# EAGLE design base-6u-generic-m16-v1 (EAGLE 4.16)
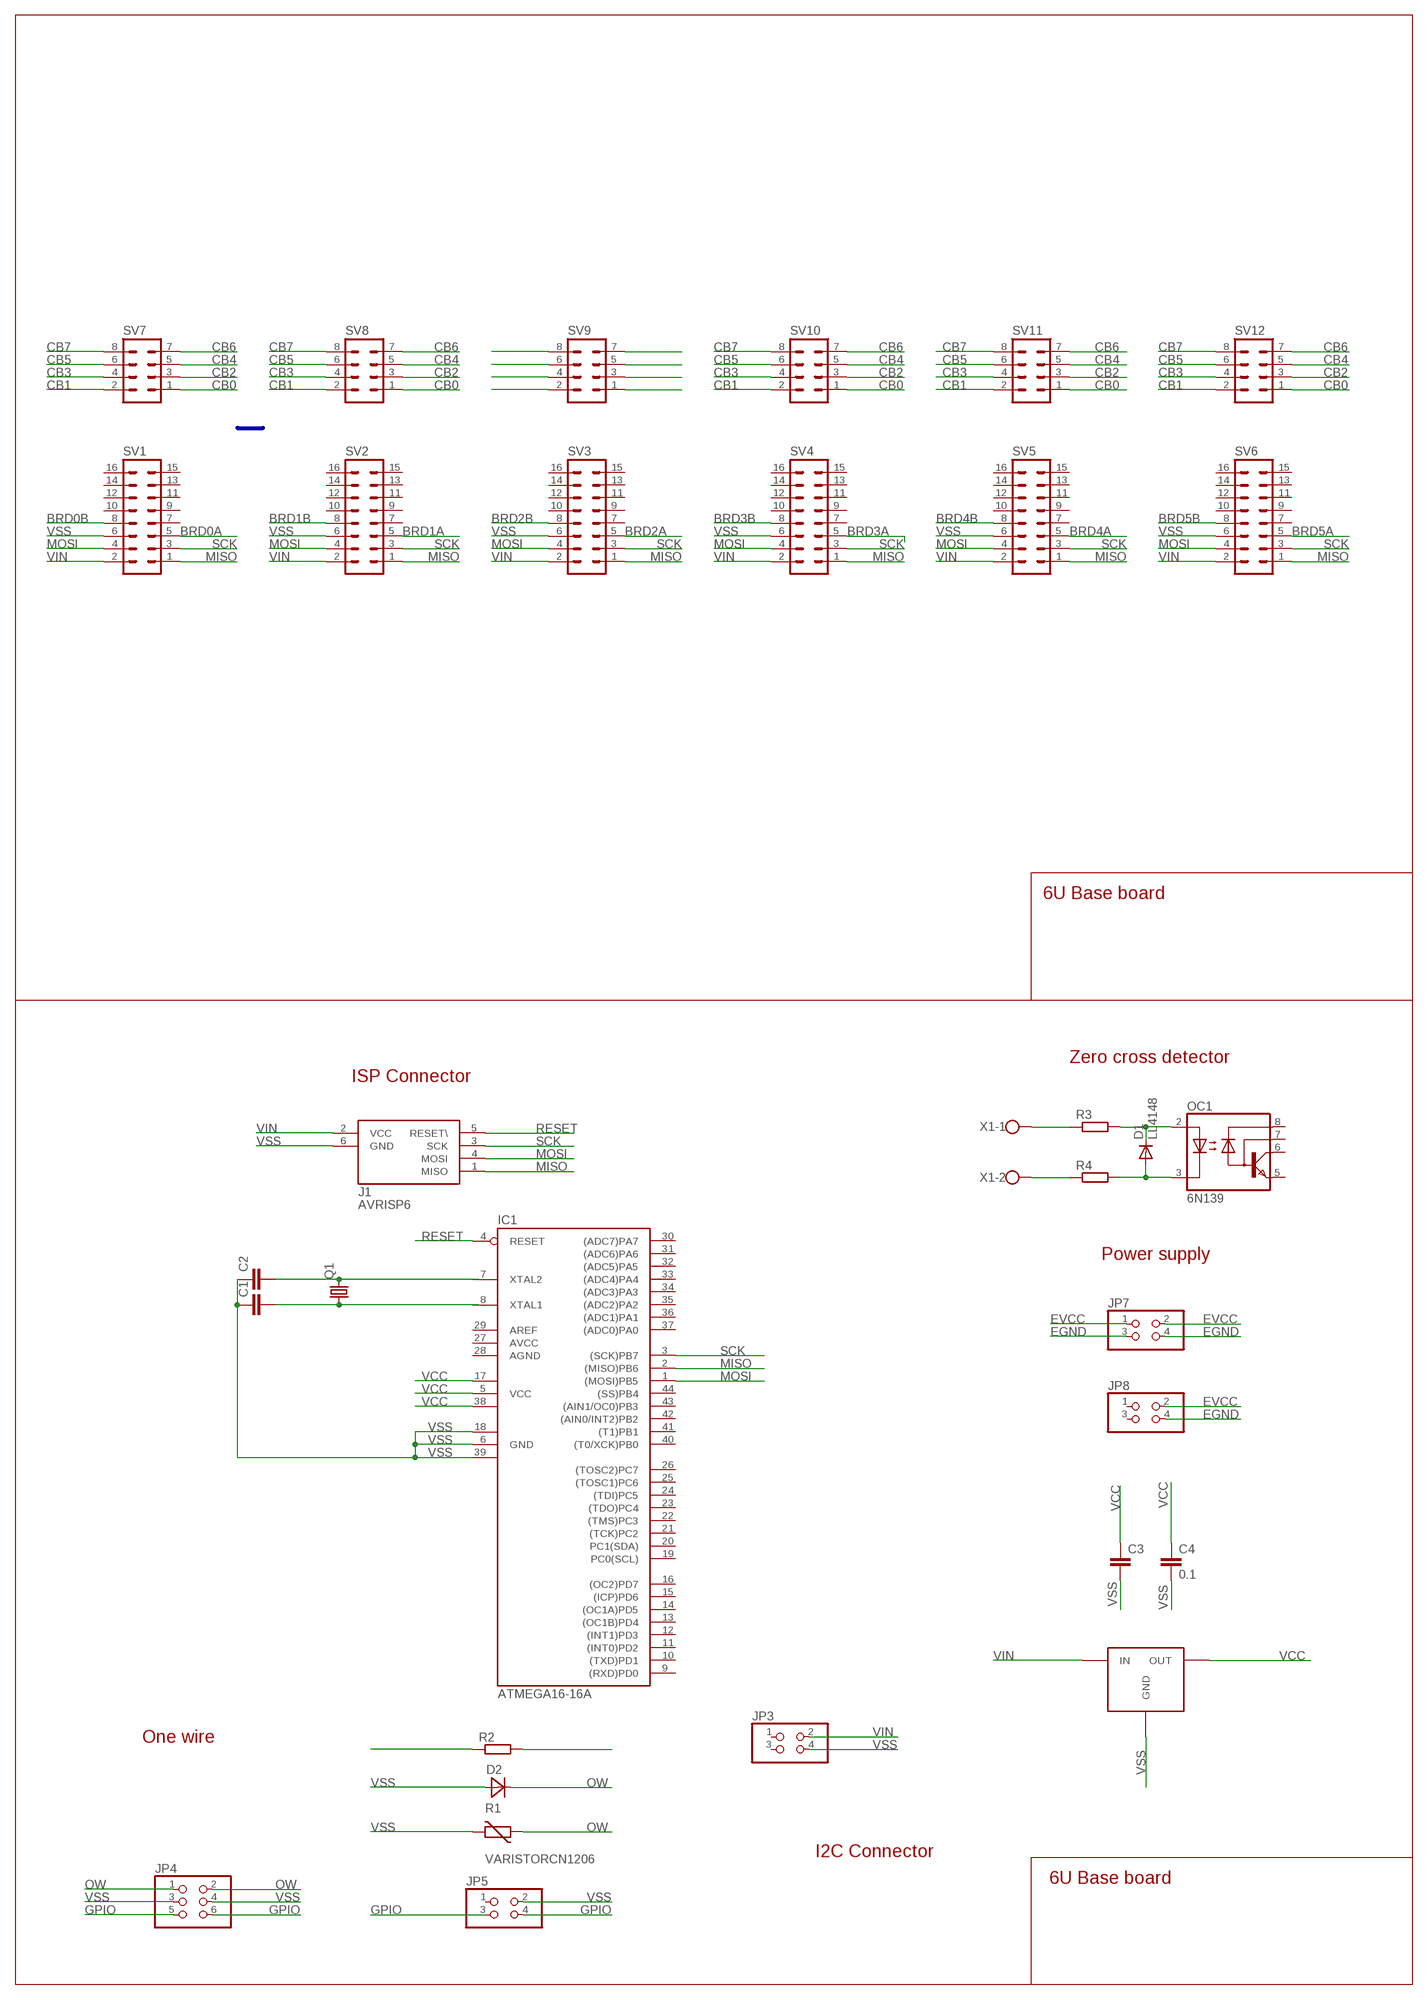
[diagram p0: schematic, sheet 1]

## Parts
C1  C-EUC0805  [C0805]
C2  C-EUC0805  [C0805]
C3  C-EUC1206  [C1206]
C4  0.1  C-EUC0805  [C0805]
D1  LL4148  [MINIMELF]
D2  DIODESOT23_13  [SOT-23]
IC1  ATMEGA16-16A  [TQFP44]
J1  AVRISP6  [CON6P2R]
JP3  PINHD-2X2  [2X02]
JP4  PINHD-2X3  [2X03]
JP5  PINHD-2X2  [2X02]
JP7  PINHD-2X2  [2X02]
JP8  PINHD-2X2  [2X02]
OC1  6N139  [DIL08]
Q1  CRYSTALHC49S  [HC49/S]
R1  VARISTORCN1206  [CT/CN1206]
R2  R-EU_R0805  [R0805]
R3  R-EU_R0805  [R0805]
R4  R-EU_R0805  [R0805]
SV1  MA08-2  [MA08-2]
SV2  MA08-2  [MA08-2]
SV3  MA08-2  [MA08-2]
SV4  MA08-2  [MA08-2]
SV5  MA08-2  [MA08-2]
SV6  MA08-2  [MA08-2]
SV7  MA04-2  [MA04-2]
SV8  MA04-2  [MA04-2]
SV9  MA04-2  [MA04-2]
SV10  MA04-2  [MA04-2]
SV11  MA04-2  [MA04-2]
SV12  MA04-2  [MA04-2]
U$1  LF33CDT  [TO-252]
X1  W237-02P  [W237-132]

## Nets
BRD0A: SV1.5
BRD0B: SV1.8
BRD1A: SV2.5
BRD1B: SV2.8
BRD2A: SV3.5
BRD2B: SV3.8
BRD3A: SV4.5
BRD3B: SV4.8
BRD4A: SV5.5
BRD4B: SV5.8
BRD5A: SV6.5
BRD5B: SV6.8
CB0: SV7.1 SV8.1 SV9.1 SV10.1 SV11.1 SV12.1
CB1: SV7.2 SV8.2 SV9.2 SV10.2 SV11.2 SV12.2
CB2: SV7.3 SV8.3 SV9.3 SV10.3 SV11.3 SV12.3
CB3: SV7.4 SV8.4 SV9.4 SV10.4 SV11.4 SV12.4
CB4: SV7.5 SV8.5 SV9.5 SV10.5 SV11.5 SV12.5
CB5: SV7.6 SV8.6 SV9.6 SV10.6 SV11.6 SV12.6
CB6: SV7.7 SV8.7 SV9.7 SV10.7 SV11.7 SV12.7
CB7: SV7.8 SV8.8 SV9.8 SV10.8 SV11.8 SV12.8
EGND: JP7.3 JP7.4 JP8.4
EVCC: JP7.1 JP7.2 JP8.2
GPIO: JP4.5 JP4.6 JP5.3 JP5.4 R2.1
MISO: IC1.2((MISO)PB6) J1.1(MISO) SV1.1 SV2.1 SV3.1 SV4.1 SV5.1 SV6.1
MOSI: IC1.1((MOSI)PB5) J1.4(MOSI) SV1.4 SV2.4 SV3.4 SV4.4 SV5.4 SV6.4
N$24: C2.2 Q1.2
N$25: C1.2 Q1.1
N$253: R3.1 X1.1
N$254: R4.1 X1.2
N$255: D1.C OC1.2(A) R3.2
N$256: D1.A OC1.3(C) R4.2
OW: D2.3(C) JP4.1 JP4.2 R1.1 R2.2
RESET: IC1.4(RESET) J1.5(RESET\)
SCK: IC1.3((SCK)PB7) J1.3(SCK) SV1.3 SV2.3 SV3.3 SV4.3 SV5.3 SV6.3
VCC: C3.1 C4.1 IC1.5(VCC) IC1.17(VCC1) IC1.38(VCC2) U$1.2(OUT)
VIN: J1.2(VCC) JP3.2 SV1.2 SV2.2 SV3.2 SV4.2 SV5.2 SV6.2 U$1.1(IN)
VSS: C1.1 C2.1 C3.2 C4.2 D2.1(A) IC1.6(GND) IC1.18(GND1) IC1.39(GND2) J1.6(GND) JP3.4 JP4.3 JP4.4 JP5.2 R1.2 SV1.6 SV2.6 SV3.6 SV4.6 SV5.6 SV6.6 U$1.3(GND)
Unconnected: IC1.7(XTAL2) IC1.8(XTAL1) IC1.9((RXD)PD0) IC1.10((TXD)PD1) IC1.11((INT0)PD2) IC1.12((INT1)PD3) IC1.13((OC1B)PD4) IC1.14((OC1A)PD5) IC1.15((ICP)PD6) IC1.16((OC2)PD7) IC1.19(PC0(SCL)) IC1.20(PC1(SDA)) IC1.21((TCK)PC2) IC1.22((TMS)PC3) IC1.23((TDO)PC4) IC1.24((TDI)PC5) IC1.25((TOSC1)PC6) IC1.26((TOSC2)PC7) IC1.30((ADC7)PA7) IC1.31((ADC6)PA6) IC1.32((ADC5)PA5) IC1.33((ADC4)PA4) IC1.34((ADC3)PA3) IC1.35((ADC2)PA2) IC1.36((ADC1)PA1) IC1.37((ADC0)PA0) IC1.40((T0/XCK)PB0) IC1.41((T1)PB1) IC1.42((AIN0/INT2)PB2) IC1.43((AIN1/OC0)PB3) IC1.44((SS)PB4) JP3.1 JP3.3 JP5.1 JP8.1 JP8.3 OC1.5(GND) OC1.6(VO) OC1.7(VB) OC1.8(VCC) SV1.7 SV1.9 SV1.10 SV1.11 SV1.12 SV1.13 SV1.14 SV1.15 SV1.16 SV2.7 SV2.9 SV2.10 SV2.11 SV2.12 SV2.13 SV2.14 SV2.15 SV2.16 SV3.7 SV3.9 SV3.10 SV3.11 SV3.12 SV3.13 SV3.14 SV3.15 SV3.16 SV4.7 SV4.9 SV4.10 SV4.11 SV4.12 SV4.13 SV4.14 SV4.15 SV4.16 SV5.7 SV5.9 SV5.10 SV5.11 SV5.12 SV5.13 SV5.14 SV5.15 SV5.16 SV6.7 SV6.9 SV6.10 SV6.11 SV6.12 SV6.13 SV6.14 SV6.15 SV6.16

## Buses
EGND

## Notes on the sheet
- 6U Base board
- Zero cross detector
- ISP Connector
- Power supply
- One wire
- I2C Connector
- 6U Base board

## Power pins joined to a net without a drawn wire
AGND: IC1.28(AGND)
AREF: IC1.29(AREF)
AVCC: IC1.27(AVCC)

## Library data of the parts
C1-C4 = rcl:C-EU: CAPACITOR, European symbol
D1 = diode-os:LL4148
D2 = ads4:DIODE: Diode Contains packages not in Eagle libraries
IC1 = avr:ATMEGA16: MICROCONTROLLER 16 Kbytes FLASH 1 kbytes SRAM 512 bytes EEPROM USART 8-channel 10 bit ADC
J1 = ads4:AVRISP6: 6-pin dual-row connector for Atmel AVRISP programmer interface
JP3 JP5 JP7 JP8 = pinhead:PINHD-2X2: PIN HEADER
JP4 = pinhead:PINHD-2X3: PIN HEADER
OC1 = optocoupler:6N139
Q1 = crystal:CRYSTAL: CRYSTAL
R1 = varistor:VARISTOR: VARISTOR
R2-R4 = rcl:R-EU_: RESISTOR, European symbol
SV1-SV6 = con-lstb:MA08-2: PIN HEADER
SV7-SV12 = con-lstb:MA04-2: PIN HEADER
U$1 = my-to252:LF33CDT
X1 = con-wago-508:W237-02P: WAGO SREW CLAMP

## Board
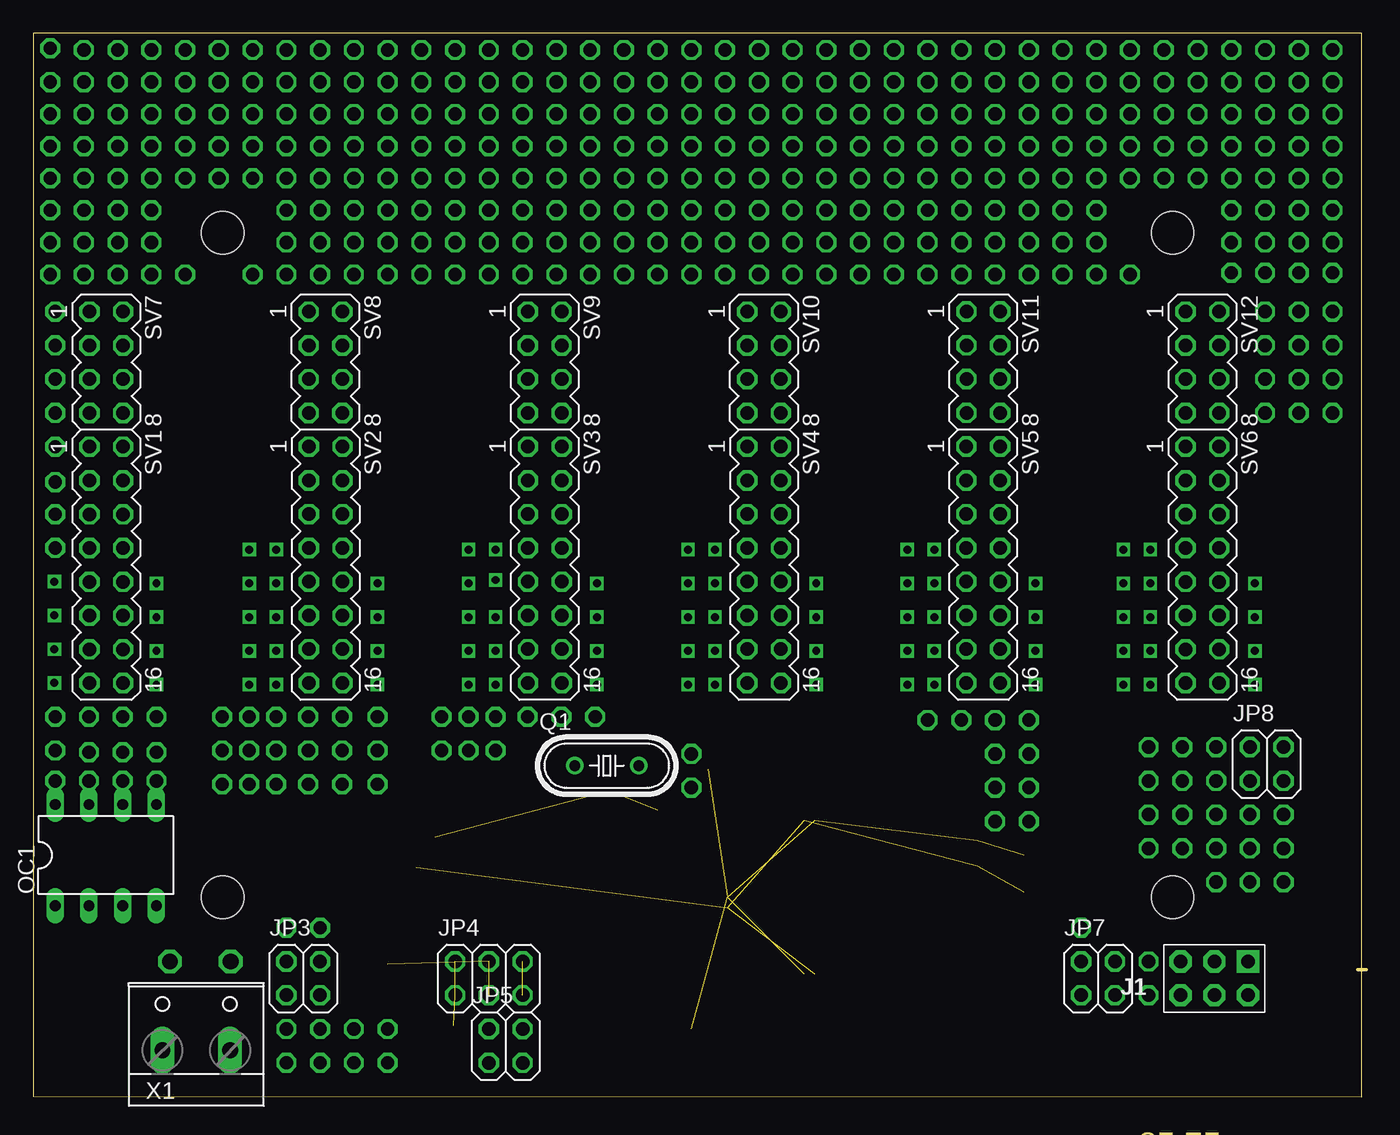
[diagram p1: board, top side]
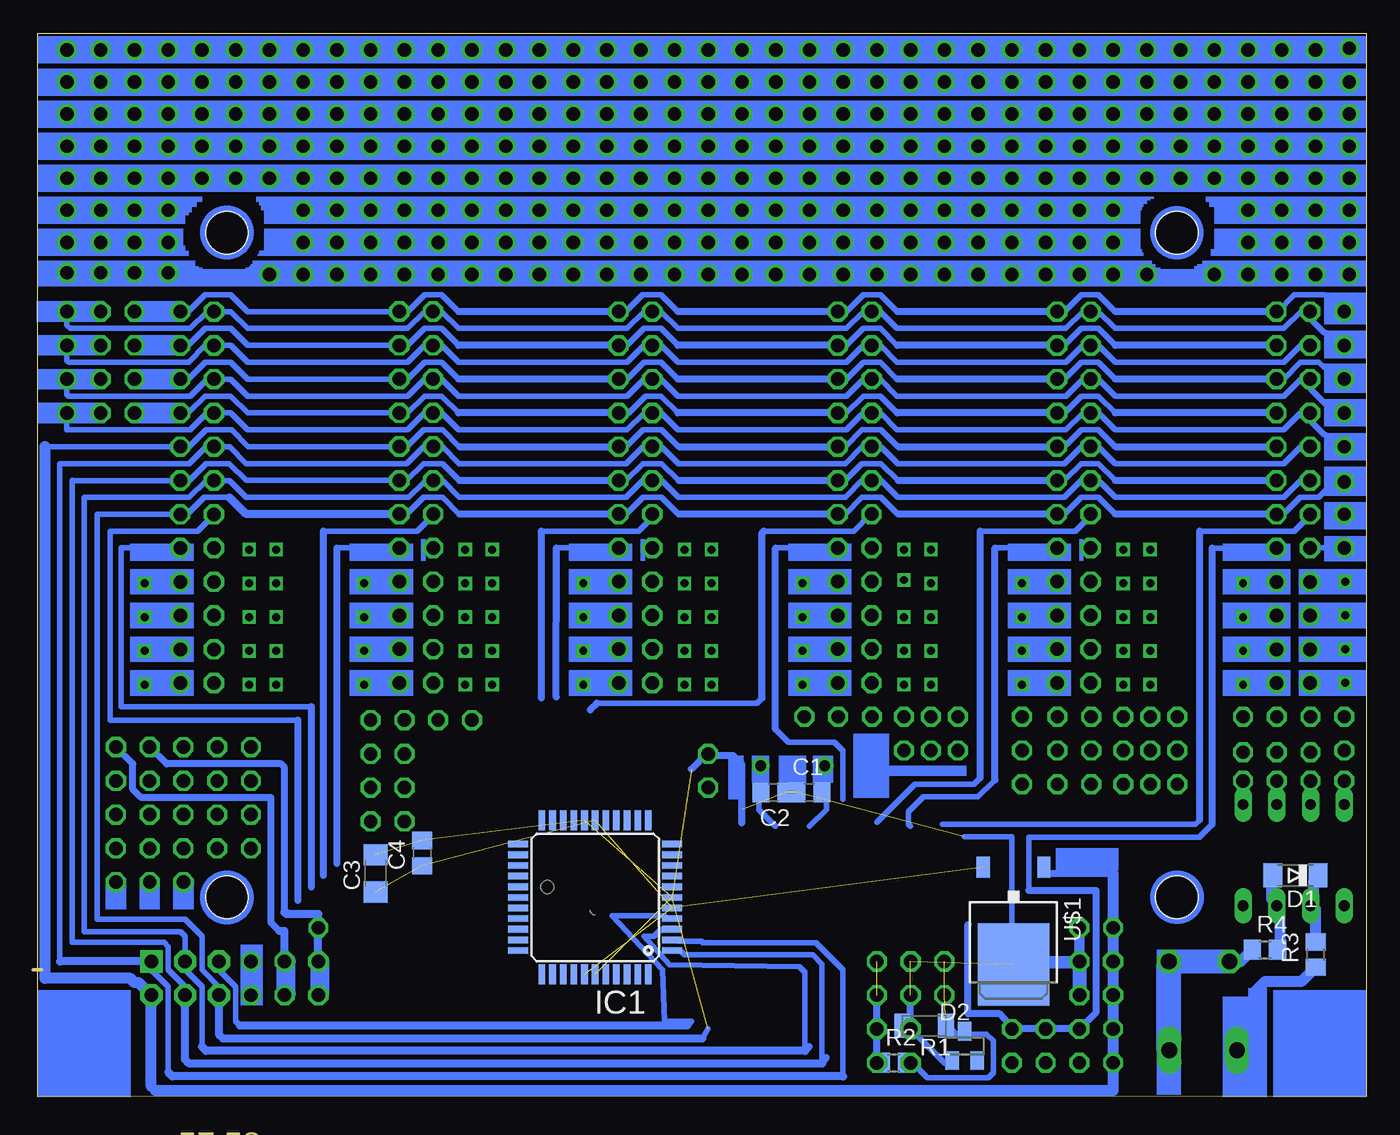
[diagram p2: board, bottom side, seen from below]

Size 100.33 x 80 mm. Coordinates in mm from the lower left corner, seen from the top.
Outline: 99.7,9.53 100.33,9.53
Outline: 0,0.01 100,0 100,80 0,80 0,0.01
Copper layers (1*16): Top 0.035mm / dielectric 1.5mm / Bottom 0.035mm
Design rules "default": minimum track width 10mil, minimum drill 24mil, track to track 8mil, track to pad 8mil, pad to pad 8mil, via to via 8mil, smd to smd 8mil, copper to edge 40mil, drill to drill 8mil, minimum pad ring 10mil, minimum via ring 8mil, stop-mask expansion 4mil, vias tented up to drill 0mil, thermal gap 10mil
Holes 3.2 mm at 14.25,15 14.25,65 85.75,15 85.75,65

### Footprints (pad centres in the part's own frame; a part is rotated, then mirrored left to right if it is on the bottom)
C0805 = smd 1.3 x 1.5: 1 -0.95,0; 2 0.95,0
C1206 = smd 1.6 x 1.8: 1 -1.4,0; 2 1.4,0
MINIMELF = smd 1.4 x 1.8: A 1.7,0; C -1.7,0
SOT-23 = smd 1 x 1.4: 1 -0.95,-1.1; 2 0.95,-1.1; 3 0,1.1
TQFP44 = smd 1.5 x 0.5: 1 -5.8,4; 2 -5.8,3.2; 3 -5.8,2.4; 4 -5.8,1.6; 5 -5.8,0.8; 6 -5.8,0; 7 -5.8,-0.8; 8 -5.8,-1.6; 9 -5.8,-2.4; 10 -5.8,-3.2; 11 -5.8,-4; 23 5.8,-4; 24 5.8,-3.2; 25 5.8,-2.4; 26 5.8,-1.6; 27 5.8,-0.8; 28 5.8,0; 29 5.8,0.8; 30 5.8,1.6; 31 5.8,2.4; 32 5.8,3.2; 33 5.8,4 | smd 0.5 x 1.5: 12 -4,-5.8; 13 -3.2,-5.8; 14 -2.4,-5.8; 15 -1.6,-5.8; 16 -0.8,-5.8; 17 0,-5.8; 18 0.8,-5.8; 19 1.6,-5.8; 20 2.4,-5.8; 21 3.2,-5.8; 22 4,-5.8; 34 4,5.8; 35 3.2,5.8; 36 2.4,5.8; 37 1.6,5.8; 38 0.8,5.8; 39 0,5.8; 40 -0.8,5.8; 41 -1.6,5.8; 42 -2.4,5.8; 43 -3.2,5.8; 44 -4,5.8
CON6P2R = drill 1.016 pad 1.676 square: 1 -2.54,-1.27 | drill 1.016 pad 1.676 octagon: 2 -2.54,1.27; 3 0,-1.27; 4 0,1.27; 5 2.54,-1.27; 6 2.54,1.27
2X02 = drill 1.016 octagon: 1 -1.27,-1.27; 2 -1.27,1.27; 3 1.27,-1.27; 4 1.27,1.27
2X03 = drill 1.016 octagon: 1 -2.54,-1.27; 2 -2.54,1.27; 3 0,-1.27; 4 0,1.27; 5 2.54,-1.27; 6 2.54,1.27
DIL08 = drill 0.813 long: 1 -3.81,-3.81; 2 -1.27,-3.81; 3 1.27,-3.81; 4 3.81,-3.81; 5 3.81,3.81; 6 1.27,3.81; 7 -1.27,3.81; 8 -3.81,3.81
HC49/S = drill 0.813 round: 1 -2.413,0; 2 2.413,0
CT/CN1206 = smd 1.2 x 1.8: 1 -1.65,0; 2 1.65,0
R0805 = smd 1.3 x 1.5: 1 -0.95,0; 2 0.95,0
MA08-2 = drill 1.016 octagon: 1 -8.89,-1.27; 2 -8.89,1.27; 3 -6.35,-1.27; 4 -6.35,1.27; 5 -3.81,-1.27; 6 -3.81,1.27; 7 -1.27,-1.27; 8 -1.27,1.27; 9 1.27,-1.27; 10 1.27,1.27; 11 3.81,-1.27; 12 3.81,1.27; 13 6.35,-1.27; 14 6.35,1.27; 15 8.89,-1.27; 16 8.89,1.27
MA04-2 = drill 1.016 octagon: 1 -3.81,-1.27; 2 -3.81,1.27; 3 -1.27,-1.27; 4 -1.27,1.27; 5 1.27,-1.27; 6 1.27,1.27; 7 3.81,-1.27; 8 3.81,1.27
TO-252 = smd 1 x 1.6: 1 -2.28,-6.07; 2 2.28,-6.07 | smd 5.4 x 6.2: 3 0,1.23
W237-132 = drill 1.194 long: 1 -2.54,-0.635; 2 2.54,-0.635

### Placement (x,y rotation side)
C1  41.92,22.89 0 bottom
C2  44.61,22.87 180 bottom
C3  74.56,16.8 90 bottom
C4  71.06,18.32 90 bottom
D1  5.34,16.64 180 bottom
D2  30.23,3.81 0 bottom
IC1  58.04,14.99 180 bottom
J1  88.9,8.89 180 top
JP3  20.32,8.89 0 top
JP4  34.29,8.89 0 top
JP5  35.56,3.81 0 top
JP7  80.14,8.89 0 top
JP8  92.84,25.02 0 top
OC1  5.46,18.16 0 top
Q1  43.17,24.89 0 top
R1  33.28,5.33 180 bottom
R2  35.56,2.54 0 bottom
R3  3.81,10.67 90 bottom
R4  7.62,11.05 0 bottom
SV1  5.5,40 270 top
SV2  22.02,40 270 top
SV3  38.51,40 270 top
SV4  55.01,40.01 270 top
SV5  71.51,40.01 270 top
SV6  88,40 270 top
SV7  5.5,55.24 270 top
SV8  22,55.24 270 top
SV9  38.5,55.24 270 top
SV10  55,55.24 270 top
SV11  71.51,55.25 270 top
SV12  88,55.24 270 top
U$1  26.55,11.18 180 bottom
X1  12.27,4.11 0 top

### Tracks (layer width: path | path; a pad name or v marks a point on that pad's centre or on a via)
BRD0A
  Bottom 0.406: SV1.5 4.23,43.72 5.4,42.55 12.54,42.55 | 12.54,20.8 12.86,20.48 31.91,20.48 | 31.91,20.48
  Bottom 0.508: 12.54,20.8 12.54,42.55
BRD0B
  Bottom 0.406: SV1.8 11.58,41.27 11.59,41.27 | 11.59,20.48 12.54,19.53 12.53,19.53 12.53,19.5 25.4,19.5 25.4,15.49
  Bottom 0.508: 11.59,20.48 11.59,41.27 | 25.4,15.49 20.32,15.49 20.32,6.35 21.59,5.08 26.55,5.08 27.56,6.22 29.98,6.22 29.98,12.95
BRD1A
  Bottom 0.406: SV2.5 20.75,43.71 21.91,42.55 29.05,42.55 | 29.05,23.97 29.53,23.5 33.98,23.5 36.83,20.64
  Bottom 0.508: 29.05,23.97 29.05,42.55
BRD1B
  Bottom 0.406: SV2.8 27.94,41.27 | 27.94,23.81 29.21,22.54 33.34,22.54 34.45,21.43 34.45,20.48 34.29,20.32
  Bottom 0.508: 27.94,23.81 27.94,41.27
BRD2A
  Bottom 0.406: SV3.5 37.31,43.81 38.58,42.55 45.34,42.55 45.41,42.55 | 57.92,29.59 45.85,29.59 45.47,29.97
  Bottom 0.508: 45.34,42.55 45.47,42.42 45.47,29.97 | 57.92,29.59 58.42,29.08
BRD2B
  Bottom 0.406: SV3.8 44.45,41.27 | 44.45,27.63 43.48,26.66 40.04,26.66 39.38,26 39.38,22.37 39.37,22.37 39.37,22.38
  Bottom 0.508: 44.45,27.63 44.45,41.27
BRD3A
  Bottom 0.406: SV4.5 53.74,43.58 54.77,42.55 62.07,42.55
  Bottom 0.508: 62.07,29.97 62.07,42.55
BRD3B
  Bottom 0.406: 60.96,41.28 SV4.8
  Bottom 0.508: 60.96,30.07 60.96,41.28
BRD4A
  Bottom 0.406: SV5.5 70.24,43.75 71.44,42.55 78.49,42.55
  Bottom 0.508: 78.49,16.64 78.49,42.55
BRD4B
  Bottom 0.406: SV5.8 77.47,41.28 77.47,41.27
  Bottom 0.508: 77.47,17.53 77.47,41.27
BRD5A
  Bottom 0.406: 86.69,43.81 86.68,43.81 | 86.69,43.81 SV6.5 | 86.69,43.81 87.95,42.55 94.56,42.55 94.56,28.32 80.39,28.32
  Bottom 0.508: 80.39,14.73 80.39,28.32
BRD5B
  Bottom 0.406: SV6.8 89.23,41.27 89.22,41.27 93.73,41.27 93.73,29.34 79.38,29.34
  Bottom 0.508: 79.38,15.75 79.38,29.34
CB0
  Bottom 0.406: SV7.1 4.93,59.05 6.19,57.78 18.89,57.78 20.16,59.05 20.64,59.05 20.65,59.05 SV8.1 21.35,59.05 22.61,57.78 35.31,57.78 36.58,59.05 37.21,59.05 37.22,59.05 SV9.1 37.85,59.05 39.12,57.78 51.82,57.78 53.09,59.05 SV10.1 54.37,59.05 55.63,57.78 68.33,57.78 69.6,59.05 SV11.1 70.87,59.06 72.14,57.78 84.2,57.78 85.47,59.05 SV12.1 | SV12.1 | SV12.1 87.25,59.05 88.52,57.78 97.54,57.78 97.79,58.04 97.79,59.05
CB1
  Bottom 0.406: SV8.2 22.71,59.05 21.43,60.33 20.16,60.33 18.89,59.05 | 6.83,59.05 6.82,59.05 SV7.2 | 35.3,59.05 36.58,60.33 37.85,60.33 39.12,59.05 39.75,59.05 39.76,59.05 SV9.2 | 51.81,59.05 53.09,60.33 54.49,60.33 55.76,59.05 SV10.2 | 68.32,59.05 69.6,60.33 70.87,60.33 72.14,59.05 SV11.2 | SV12.2 88.66,59.05 87.38,60.33 85.47,60.33 84.2,59.05 SV11.2 | SV11.2
  Bottom 0.508: 6.83,59.05 18.89,59.05 | SV8.2 35.3,59.05 | SV9.2 51.81,59.05 | SV10.2 68.32,59.05
CB2
  Bottom 0.406: SV7.3 4.93,56.51 6.19,55.24 18.89,55.24 20.16,56.52 20.64,56.52 20.65,56.51 SV8.3 21.35,56.51 22.61,55.24 35.31,55.24 36.58,56.52 37.21,56.52 37.22,56.51 SV9.3 37.85,56.51 39.12,55.24 51.82,55.24 53.09,56.52 SV10.3 54.37,56.51 55.63,55.24 68.33,55.24 69.6,56.52 SV11.3 70.87,56.52 72.14,55.24 84.2,55.24 85.47,56.52 SV12.3 | SV12.3 | SV12.3 87.38,56.52 88.65,55.24 97.67,55.24 97.79,55.37 97.79,56.52
CB3
  Bottom 0.406: 18.89,56.52 20.16,57.78 21.43,57.78 22.71,56.51 SV8.4 23.25,56.51 23.24,56.52 | 6.83,56.52 6.82,56.51 SV7.4 | 51.82,56.52 53.09,57.78 54.36,57.78 55.64,56.51 SV10.4 | 39.75,56.52 39.76,56.51 SV9.4 39.12,56.51 37.85,57.78 36.58,57.78 35.31,56.52 | 68.33,56.52 69.6,57.78 70.87,57.78 72.14,56.52 SV11.4 84.2,56.52 85.47,57.78 87.38,57.78 88.66,56.51 SV12.4
  Bottom 0.508: 6.83,56.52 18.89,56.52 | 39.75,56.52 51.82,56.52 | 23.24,56.52 35.31,56.52 | SV10.4 68.33,56.52
CB4
  Bottom 0.406: SV7.5 4.93,53.97 6.19,52.7 18.89,52.7 20.16,53.98 20.64,53.98 20.65,53.97 SV8.5 21.35,53.97 22.61,52.7 35.31,52.7 36.58,53.98 37.21,53.98 37.22,53.97 SV9.5 37.85,53.97 39.12,52.7 51.82,52.7 53.09,53.98 SV10.5 54.37,53.97 55.63,52.7 68.33,52.7 69.6,53.98 SV11.5 70.87,53.98 72.14,52.7 84.2,52.7 85.47,53.98 SV12.5 | SV12.5 | SV12.5 87.25,53.98 88.52,52.7 97.67,52.7 97.79,52.83 97.79,53.98
CB5
  Bottom 0.406: 18.89,53.98 20.16,55.24 21.43,55.24 22.71,53.97 SV8.6 23.25,53.97 23.24,53.98 | 6.83,53.98 6.82,53.97 SV7.6 | 35.31,53.98 36.58,55.24 37.85,55.24 39.12,53.97 SV9.6 39.76,53.97 39.75,53.98 | 68.33,53.98 69.6,55.24 70.87,55.24 72.14,53.98 SV11.6 84.21,53.98 85.47,55.24 87.38,55.24 88.66,53.97 SV12.6 | SV10.6 55.64,53.97 54.36,55.24 53.09,55.24 51.82,53.98
  Bottom 0.508: 6.83,53.98 18.89,53.98 | 23.24,53.98 35.31,53.98 | SV10.6 68.33,53.98 | 39.75,53.98 51.82,53.98
CB6
  Bottom 0.406: SV7.7 4.93,51.43 6.19,50.16 18.89,50.16 20.16,51.44 20.64,51.44 20.65,51.43 SV8.7 21.35,51.43 22.61,50.16 35.31,50.16 36.58,51.44 37.21,51.44 37.22,51.43 SV9.7 37.85,51.43 39.12,50.16 51.82,50.16 53.09,51.44 SV10.7 54.37,51.43 55.63,50.16 68.33,50.16 69.6,51.44 SV11.7 70.87,51.44 72.14,50.16 84.2,50.16 85.47,51.44 SV12.7 | SV12.7 | SV12.7 87.25,51.44 88.52,50.16 97.79,50.16 97.79,51.44
CB7
  Bottom 0.406: 18.89,51.44 20.16,52.7 21.43,52.7 22.71,51.43 SV8.8 23.25,51.43 23.24,51.44 | 6.83,51.44 6.82,51.43 SV7.8 | 35.31,51.44 36.58,52.7 37.85,52.7 39.12,51.43 SV9.8 39.76,51.43 39.75,51.44 | 51.82,51.44 53.09,52.7 54.23,52.7 55.51,51.43 SV10.8 | 68.33,51.44 69.6,52.7 70.87,52.7 72.14,51.44 SV11.8 84.2,51.44 85.47,52.7 87.38,52.7 88.66,51.43 SV12.8
  Bottom 0.508: 6.83,51.44 18.89,51.44 | 23.24,51.44 35.31,51.44 | 39.75,51.44 51.82,51.44 | SV10.8 68.33,51.44
EGND
  Bottom 0.508: 81.79,12.45 82.43,13.08 82.43,22.48 92.21,22.48 92.84,23.11 92.84,25.02 JP8.4
  Bottom 0.61: JP7.4 81.41,12.45 81.79,12.45
  Bottom 1.422: JP7.4 81.28,10.16 81.28,7.75 JP7.3
EVCC
  Bottom 0.508: 81.28,13.72 81.28,13.84 | 81.41,13.84 81.41,24.77 81.66,25.02 90.3,25.02 JP8.2
  Bottom 0.61: JP7.2 78.87,13.72 81.28,13.72 | 81.28,13.84 81.41,13.84
  Bottom 1.422: JP7.2 78.74,10.16 78.74,7.75 JP7.1
GPIO  (1 unrouted)
  Bottom 0.406: R2.1 JP5.3
  Bottom 0.508: JP5.3 JP5.4 JP4.5
MISO
  Bottom 0.406: SV4.1 53.74,48.97 | 70.17,48.9 SV5.1 | 70.17,48.9 70.96,48.9 72.23,47.62 84.3,47.62 85.56,48.89 SV6.1 87.32,48.89 88.59,47.62 98.33,47.62 98.33,10.16 | 70.17,48.9 69.54,48.9 68.27,47.62 55.72,47.62 54.45,48.9 53.82,48.9 SV4.1 | SV4.1 53.03,48.9 51.76,47.62 39.21,47.62 37.94,48.9 37.15,48.9 | 37.15,48.9 37.15,48.89 SV3.1 | 37.15,48.9 36.52,48.9 35.25,47.62 22.7,47.62 21.44,48.89 SV2.1 20.64,48.89 20.64,48.9 20.16,48.9 18.89,47.62 6.19,47.62 4.93,48.89 SV1.1 | 90.17,1.84 90.17,8.26 91.44,9.53 | 39.37,1.52 39.37,9.53 41.41,11.56 49.91,11.56 50.04,11.68 51.82,11.68 51.95,11.81 51.97,11.79 IC1.2
  Bottom 0.61: 39.37,1.52 89.86,1.52 90.17,1.84 | 91.44,9.53 J1.1 98.33,10.16
MOSI
  Bottom 0.406: SV6.4 88.59,46.35 87.32,47.62 85.57,47.62 84.3,46.36 SV5.4 72.23,46.36 70.96,47.62 69.54,47.62 68.27,46.35 | 56.36,46.35 56.36,46.36 SV4.4 55.72,46.36 54.45,47.62 53.03,47.62 51.76,46.35 | 39.85,46.35 SV3.4 39.22,46.35 37.94,47.62 36.52,47.62 35.25,46.35 | 23.34,46.35 SV2.4 22.71,46.35 21.43,47.62 20.16,47.62 18.89,46.35 | 6.83,46.35 6.82,46.35 SV1.4 | 89.22,46.35 89.23,46.35 SV6.4 | J1.4 88.9,8.26 90.17,9.53 90.17,11.27 90.49,11.59 97.41,11.59 97.41,46.35 97.4,46.35 SV6.4 | 40.96,2.48 40.96,9.97 41.66,10.67 51.31,10.67 51.57,10.92 51.95,10.92 52.07,11.05 52.14,10.99 IC1.1
  Bottom 0.508: 68.27,46.35 56.36,46.35 | 51.76,46.35 39.85,46.35 | 35.25,46.35 23.34,46.35 | 18.89,46.35 6.83,46.35 | 40.96,2.48 40.64,2.92
  Bottom 0.61: 40.96,2.48 88.59,2.48 88.9,2.79 J1.4
N$1
  Bottom 0.406: 3.02,57.47 3.18,57.47 4.29,58.58 4.29,58.9
N$2
  Bottom 0.406: 6.67,59.05 5.4,60.33 3.18,60.33
N$3  (via drill 1)
  other vias: 1.65,41.27
N$4  (via drill 1)
  other vias: 1.65,43.81
N$5  (via drill 1)
  other vias: 1.65,46.23
N$6  (via drill 1)
  other vias: 1.65,48.9
N$7
  Bottom 0.406: 3.05,54.86 3.18,54.86 3.56,55.24 4.96,55.24 6.23,53.98 6.73,53.98
N$8
  Bottom 0.406: 3.05,52.07 4.19,53.21 4.19,53.98
N$9
  Bottom 0.406: 3.05,49.78 3.18,49.78 4.19,50.8 4.19,51.31
N$10
  Bottom 0.406: 6.73,43.69 6.35,43.69 4.96,45.09 3.56,45.09 2.92,45.72
N$11
  Bottom 0.406: 4.19,41.27 2.92,41.27
N$12  (via drill 1)
  other vias: 1.65,51.44
N$13  (via drill 1)
  other vias: 1.65,53.98
N$14  (via drill 1)
  other vias: 1.65,56.52
N$15  (via drill 1)
  other vias: 1.65,59.05
N$17  (via drill 1)
  other vias: 94.11,21.21
N$18  (via drill 1)
  other vias: 83.95,7.62
N$19  (via drill 1)
  other vias: 89.03,23.75
N$20  (via drill 1)
  other vias: 91.57,21.21
N$21  (via drill 1)
  other vias: 86.49,23.75
N$22  (via drill 1)
  other vias: 89.03,21.21
N$23  (via drill 1)
  other vias: 83.95,23.75
N$24
  Bottom 0.406: Q1.2 45.72,25.4 45.72,22.86 | 45.72,22.86 45.72,21.59 44.45,20.32 | C2.2 45.71,22.87 45.72,22.86
N$25
  Bottom 0.406: Q1.1 40.64,25.4 40.64,22.86 | 40.64,22.86 40.64,21.59 41.91,20.32 | C1.2 40.67,22.89 40.64,22.86
N$26  (via drill 0.6)
  other vias: 1.59,38.73
N$27  (via drill 0.6)
  other vias: 1.59,36.2
N$28  (via drill 0.6)
  other vias: 1.59,33.66
N$29  (via drill 0.6)
  other vias: 1.59,31.11
N$30  (via drill 0.6)
  other vias: 9.27,30.99
N$31  (via drill 0.6)
  other vias: 9.27,33.53
N$32  (via drill 0.6)
  other vias: 9.27,36.07
N$33  (via drill 0.6)
  other vias: 9.27,38.61
N$34  (via drill 0.6)
  other vias: 16.26,30.99
N$35  (via drill 0.6)
  other vias: 16.26,33.53
N$36  (via drill 0.6)
  other vias: 16.26,36.07
N$37  (via drill 0.6)
  other vias: 16.26,38.61
N$38  (via drill 0.6)
  other vias: 16.26,41.15
N$39  (via drill 0.6)
  other vias: 18.29,41.15
N$45  (via drill 0.6)
  other vias: 18.29,30.99
N$46  (via drill 0.6)
  other vias: 18.29,33.53
N$47  (via drill 0.6)
  other vias: 18.29,36.07
N$48  (via drill 0.6)
  other vias: 18.29,38.61
N$49  (via drill 0.6)
  other vias: 25.91,30.99
N$50  (via drill 0.6)
  other vias: 25.91,33.53
N$51  (via drill 0.6)
  other vias: 25.91,36.07
N$52  (via drill 0.6)
  other vias: 25.91,38.61
N$53  (via drill 0.6)
  other vias: 32.77,30.99
N$54  (via drill 0.6)
  other vias: 32.77,33.53
N$55  (via drill 0.6)
  other vias: 32.77,36.07
N$56  (via drill 0.6)
  other vias: 32.77,38.61
N$57  (via drill 0.6)
  other vias: 32.77,41.15
N$58  (via drill 0.6)
  other vias: 34.8,41.15
N$59  (via drill 0.6)
  other vias: 34.8,38.86
N$60  (via drill 0.6)
  other vias: 34.8,36.07
N$61  (via drill 0.6)
  other vias: 34.8,33.53
N$62  (via drill 0.6)
  other vias: 34.8,30.99
N$68  (via drill 0.6)
  other vias: 42.42,30.99
N$69  (via drill 0.6)
  other vias: 42.42,33.53
N$70  (via drill 0.6)
  other vias: 42.42,36.07
N$71  (via drill 0.6)
  other vias: 42.42,38.61
N$72  (via drill 0.6)
  other vias: 49.28,30.99
N$73  (via drill 0.6)
  other vias: 49.28,33.53
N$74  (via drill 0.6)
  other vias: 49.28,36.07
N$75  (via drill 0.6)
  other vias: 49.28,38.61
N$76  (via drill 0.6)
  other vias: 49.28,41.15
N$77  (via drill 0.6)
  other vias: 51.31,41.15
N$78  (via drill 0.6)
  other vias: 51.31,38.61
N$79  (via drill 0.6)
  other vias: 51.31,36.07
N$80  (via drill 0.6)
  other vias: 51.31,33.53
N$81  (via drill 0.6)
  other vias: 51.31,30.99
N$87  (via drill 0.6)
  other vias: 58.93,30.99
N$88  (via drill 0.6)
  other vias: 58.93,33.53
N$89  (via drill 0.6)
  other vias: 58.93,36.07
N$90  (via drill 0.6)
  other vias: 58.93,38.61
N$91  (via drill 0.6)
  other vias: 65.79,30.99
N$92  (via drill 0.6)
  other vias: 65.79,33.53
N$93  (via drill 0.6)
  other vias: 65.79,36.07
N$94  (via drill 0.6)
  other vias: 65.79,38.61
N$95  (via drill 0.6)
  other vias: 65.79,41.15
N$96  (via drill 0.6)
  other vias: 67.82,41.15
N$97  (via drill 0.6)
  other vias: 67.82,38.61
N$98  (via drill 0.6)
  other vias: 67.82,36.07
N$99  (via drill 0.6)
  other vias: 67.82,33.53
N$100  (via drill 0.6)
  other vias: 67.82,30.99
N$106  (via drill 0.6)
  other vias: 75.44,30.99
N$107  (via drill 0.6)
  other vias: 75.44,33.53
N$108  (via drill 0.6)
  other vias: 75.44,36.07
N$109  (via drill 0.6)
  other vias: 75.44,38.61
N$110  (via drill 0.6)
  other vias: 82.05,30.99
N$111  (via drill 0.6)
  other vias: 82.05,33.53
N$112  (via drill 0.6)
  other vias: 82.05,36.07
N$113  (via drill 0.6)
  other vias: 82.05,38.61
N$114  (via drill 0.6)
  other vias: 82.05,41.15
N$115  (via drill 0.6)
  other vias: 84.08,41.15
N$116  (via drill 0.6)
  other vias: 84.08,38.61
N$117  (via drill 0.6)
  other vias: 84.08,36.07
N$118  (via drill 0.6)
  other vias: 84.08,33.53
N$119  (via drill 0.6)
  other vias: 84.08,30.99
N$125  (via drill 0.6)
  other vias: 91.95,30.99
N$126  (via drill 0.6)
  other vias: 91.95,33.53
N$127  (via drill 0.6)
  other vias: 91.95,36.07
N$128  (via drill 0.6)
  other vias: 91.95,38.61
N$129  (via drill 1)
  other vias: 92.71,51.44
N$130  (via drill 1)
  other vias: 92.71,53.98
N$131  (via drill 1)
  other vias: 92.71,56.52
N$132  (via drill 1)
  other vias: 92.71,59.05
N$133  (via drill 1)
  other vias: 95.25,59.05
N$134  (via drill 1)
  other vias: 97.79,59.05
N$136  (via drill 1)
  other vias: 95.25,56.52
N$137  (via drill 1)
  other vias: 97.79,56.52
N$139  (via drill 1)
  other vias: 95.25,53.98
N$140  (via drill 1)
  other vias: 97.79,53.98
N$142  (via drill 1)
  other vias: 95.25,51.44
N$143  (via drill 1)
  other vias: 97.79,51.44
N$145  (via drill 1)
  other vias: 86.49,21.21
N$146  (via drill 1)
  other vias: 83.95,21.21
N$147  (via drill 1)
  other vias: 83.95,10.16
N$148  (via drill 1)
  other vias: 83.95,26.29
N$149  (via drill 1)
  other vias: 86.49,18.67
N$150  (via drill 1)
  other vias: 86.49,26.29
N$151  (via drill 1)
  other vias: 49.53,23.24
N$152  (via drill 1)
  other vias: 89.03,26.29
N$153  (via drill 1)
  other vias: 89.03,18.67
N$154  (via drill 1)
  other vias: 49.53,25.78
N$156  (via drill 1)
  other vias: 89.03,16.13
N$159  (via drill 1)
  other vias: 91.57,18.67
N$161  (via drill 1)
  other vias: 91.57,16.13
N$163  (via drill 1)
  other vias: 83.95,18.67
N$165  (via drill 1)
  other vias: 94.11,18.67
N$167  (via drill 1)
  other vias: 94.11,16.13
N$174  (via drill 1)
  other vias: 78.87,12.7
N$181  (via drill 1)
  other vias: 57.15,61.85
N$183  (via drill 1)
  other vias: 69.85,28.32
N$187  (via drill 1)
  other vias: 72.39,25.78
N$191  (via drill 1)
  other vias: 72.39,28.32
N$193  (via drill 1)
  other vias: 67.31,28.32
N$194  (via drill 1)
  other vias: 72.39,20.7
N$195  (via drill 1)
  other vias: 57.15,64.26
N$196  (via drill 1)
  other vias: 74.93,20.7
N$197  (via drill 1)
  other vias: 74.93,28.32
N$199  (via drill 1)
  other vias: 72.39,23.24
N$200  (via drill 1)
  other vias: 57.15,66.67
N$201  (via drill 1)
  other vias: 74.93,23.24
N$202  (via drill 1)
  other vias: 57.15,69.09
N$203  (via drill 1)
  other vias: 74.93,25.78
N$204  (via drill 1)
  other vias: 57.15,71.5
N$206  (via drill 1)
  other vias: 57.15,73.91
N$207  (via drill 1)
  other vias: 57.15,76.33
N$208  (via drill 1)
  other vias: 57.15,78.74
N$209  (via drill 1)
  other vias: 59.69,61.85
N$210  (via drill 1)
  other vias: 59.69,69.09
N$211  (via drill 1)
  other vias: 62.23,61.85
N$212  (via drill 1)
  other vias: 49.53,61.85
N$213  (via drill 1)
  other vias: 64.77,61.85
N$214  (via drill 1)
  other vias: 62.23,69.09
N$215  (via drill 1)
  other vias: 67.31,61.85
N$216  (via drill 1)
  other vias: 59.69,78.74
N$217  (via drill 1)
  other vias: 69.85,61.85
N$218  (via drill 1)
  other vias: 64.77,69.09
N$219  (via drill 1)
  other vias: 59.69,64.26
N$220  (via drill 1)
  other vias: 67.31,78.74
N$221  (via drill 1)
  other vias: 62.23,64.26
N$222  (via drill 1)
  other vias: 59.69,71.5
N$223  (via drill 1)
  other vias: 64.77,64.26
N$224  (via drill 1)
  other vias: 59.69,76.33
N$225  (via drill 1)
  other vias: 67.31,64.26
N$226  (via drill 1)
  other vias: 62.23,71.5
N$227  (via drill 1)
  other vias: 69.85,64.26
N$229  (via drill 1)
  other vias: 72.39,64.26
N$230  (via drill 1)
  other vias: 64.77,71.5
N$231  (via drill 1)
  other vias: 72.39,61.85
N$232  (via drill 1)
  other vias: 62.23,76.33
N$233  (via drill 1)
  other vias: 74.93,61.85
N$234  (via drill 1)
  other vias: 59.69,73.91
N$235  (via drill 1)
  other vias: 77.47,61.85
N$236  (via drill 1)
  other vias: 69.85,78.74
N$237  (via drill 1)
  other vias: 80.01,61.85
N$238  (via drill 1)
  other vias: 62.23,73.91
N$239  (via drill 1)
  other vias: 82.55,61.85
N$240  (via drill 1)
  other vias: 64.77,76.33
N$241  (via drill 1)
  other vias: 74.93,64.26
N$242  (via drill 1)
  other vias: 64.77,73.91
N$243  (via drill 1)
  other vias: 77.47,64.26
N$244  (via drill 1)
  other vias: 46.99,61.85
N$245  (via drill 1)
  other vias: 80.01,64.26
N$246  (via drill 1)
  other vias: 62.23,78.74
N$247  (via drill 1)
  other vias: 67.31,76.33
N$248  (via drill 1)
  other vias: 59.69,66.67
N$249  (via drill 1)
  other vias: 64.77,78.74
N$250  (via drill 1)
  other vias: 62.23,66.67
N$251  (via drill 1)
  other vias: 31.75,78.74
N$252  (via drill 1)
  other vias: 64.77,66.67
N$253
  Bottom 0.813: R3.1 4.9,8.64 7.62,8.64 8.39,7.87 8.39,3.68 8.64,3.43 9.91,3.43 | 9.91,3.43 | 9.91,3.43 X1.1
N$254
  Bottom 0.813: R4.1 9.46,10.16 15.24,10.16 15.37,9.91 15.37,3.43 14.99,3.43 X1.2
N$255
  Bottom 0.813: D1.C 3.94,16.33 3.94,14.35 OC1.2 3.81,14.1 R3.2
N$256
  Bottom 0.813: R4.2 6.48,11.24 6.48,14.48 OC1.3 7.12,14.86 7.12,16.56 D1.A
N$257  (via drill 1)
  other vias: 21.59,5.08
N$258  (via drill 1)
  other vias: 21.59,2.54
N$259  (via drill 1.2)
  other vias: 14.86,10.16
N$260  (via drill 1)
  other vias: 24.13,5.08
N$261  (via drill 1)
  other vias: 24.13,2.54
N$262  (via drill 1.2)
  other vias: 10.29,10.16
N$263  (via drill 1)
  other vias: 26.67,5.08
N$264  (via drill 1)
  other vias: 26.67,2.54
N$265  (via drill 1)
  other vias: 21.59,12.7
N$266  (via drill 1)
  other vias: 18.29,23.5
N$267  (via drill 1)
  other vias: 9.27,23.75
N$268  (via drill 1)
  other vias: 20.7,23.5
N$269  (via drill 1)
  other vias: 18.29,26.04
N$270  (via drill 1)
  other vias: 23.24,23.5
N$271  (via drill 1)
  other vias: 25.91,26.04
N$272  (via drill 1)
  other vias: 14.23,23.5
N$273  (via drill 1)
  other vias: 14.23,26.04
N$274  (via drill 1)
  other vias: 25.91,28.57
N$275  (via drill 1)
  other vias: 6.73,23.75
N$276  (via drill 1)
  other vias: 23.24,28.57
N$277  (via drill 1)
  other vias: 25.91,23.5
N$278  (via drill 1)
  other vias: 4.19,23.75
N$279  (via drill 1)
  other vias: 20.7,26.04
N$280  (via drill 1)
  other vias: 14.23,28.57
N$281  (via drill 1)
  other vias: 20.7,28.57
N$282  (via drill 1)
  other vias: 1.65,23.75
N$283  (via drill 1)
  other vias: 23.24,26.04
N$284  (via drill 1)
  other vias: 19.05,12.7
N$285  (via drill 1)
  other vias: 16.26,26.04
N$286  (via drill 1)
  other vias: 30.74,28.57
N$287  (via drill 1)
  other vias: 18.29,28.57
N$288  (via drill 1)
  other vias: 4.19,28.57
N$289  (via drill 1)
  other vias: 16.26,28.57
N$290  (via drill 1)
  other vias: 6.73,28.57
N$291  (via drill 1)
  other vias: 16.26,23.5
N$292  (via drill 1)
  other vias: 1.65,28.57
N$293  (via drill 1)
  other vias: 39.75,28.57
N$294  (via drill 1)
  other vias: 1.65,26.04
N$295  (via drill 1)
  other vias: 54.61,78.74
N$296  (via drill 1)
  other vias: 4.19,25.91
N$297  (via drill 1)
  other vias: 42.29,28.57
N$298  (via drill 1)
  other vias: 6.73,25.91
N$299  (via drill 1)
  other vias: 30.74,26.04
N$300  (via drill 1)
  other vias: 37.21,28.57
N$301  (via drill 1)
  other vias: 32.77,26.04
N$302  (via drill 1)
  other vias: 9.27,28.57
N$303  (via drill 1)
  other vias: 9.27,25.91
N$304  (via drill 1)
  other vias: 34.8,28.57
N$305  (via drill 1)
  other vias: 34.8,26.04
N$306  (via drill 1)
  other vias: 32.77,28.57
N$307  (via drill 1)
  other vias: 69.85,76.33
N$308  (via drill 1)
  other vias: 52.07,78.74
N$310  (via drill 1)
  other vias: 44.45,61.85
N$311  (via drill 1)
  other vias: 54.61,76.33
N$312  (via drill 1)
  other vias: 67.31,73.91
N$313  (via drill 1)
  other vias: 52.07,76.33
N$314  (via drill 1)
  other vias: 29.21,78.74
N$316  (via drill 1)
  other vias: 54.61,73.91
N$317  (via drill 1)
  other vias: 69.85,73.91
N$318  (via drill 1)
  other vias: 54.61,71.5
N$319  (via drill 1)
  other vias: 49.53,64.26
N$320  (via drill 1)
  other vias: 52.07,71.5
N$322  (via drill 1)
  other vias: 67.31,71.5
N$323  (via drill 1)
  other vias: 52.07,73.91
N$324  (via drill 1)
  other vias: 26.67,78.74
N$326  (via drill 1)
  other vias: 54.61,69.09
N$327  (via drill 1)
  other vias: 69.85,71.5
N$328  (via drill 1)
  other vias: 52.07,69.09
N$329  (via drill 1)
  other vias: 24.13,78.74
N$330  (via drill 1)
  other vias: 46.99,64.26
N$331  (via drill 1)
  other vias: 54.61,66.67
N$332  (via drill 1)
  other vias: 67.31,69.09
N$333  (via drill 1)
  other vias: 52.07,66.67
N$336  (via drill 1)
  other vias: 54.61,64.26
N$337  (via drill 1)
  other vias: 69.85,69.09
N$338  (via drill 1)
  other vias: 52.07,64.26
N$339  (via drill 1)
  other vias: 31.75,76.33
N$340  (via drill 1)
  other vias: 44.45,64.26
N$341  (via drill 1)
  other vias: 54.61,61.85
N$342  (via drill 1)
  other vias: 67.31,66.67
N$343  (via drill 1)
  other vias: 52.07,61.85
N$346  (via drill 1)
  other vias: 69.85,66.67
N$347  (via drill 1)
  other vias: 49.53,66.67
N$348  (via drill 1)
  other vias: 72.39,66.67
N$349  (via drill 1)
  other vias: 97.79,69.09
N$350  (via drill 1)
  other vias: 74.93,66.67
N$351  (via drill 1)
  other vias: 29.21,76.33
N$352  (via drill 1)
  other vias: 77.47,66.67
N$353  (via drill 1)
  other vias: 97.79,66.67
N$354  (via drill 1)
  other vias: 80.01,66.67
N$355  (via drill 1)
  other vias: 46.99,66.67
N$356  (via drill 1)
  other vias: 72.39,69.09
N$357  (via drill 1)
  other vias: 97.79,71.5
N$358  (via drill 1)
  other vias: 74.93,69.09
N$360  (via drill 1)
  other vias: 77.47,69.09
N$361  (via drill 1)
  other vias: 44.45,66.67
N$362  (via drill 1)
  other vias: 80.01,69.09
N$363  (via drill 1)
  other vias: 72.39,76.33
N$364  (via drill 1)
  other vias: 72.39,71.5
N$366  (via drill 1)
  other vias: 74.93,71.5
N$367  (via drill 1)
  other vias: 74.93,76.33
N$368  (via drill 1)
  other vias: 77.47,71.5
N$369  (via drill 1)
  other vias: 49.53,69.09
N$370  (via drill 1)
  other vias: 80.01,71.5
N$371  (via drill 1)
  other vias: 77.47,76.33
N$372  (via drill 1)
  other vias: 82.55,69.09
N$373  (via drill 1)
  other vias: 26.67,76.33
N$374  (via drill 1)
  other vias: 85.09,69.09
N$375  (via drill 1)
  other vias: 72.39,78.74
N$376  (via drill 1)
  other vias: 46.99,69.09
N$377  (via drill 1)
  other vias: 82.55,71.5
N$378  (via drill 1)
  other vias: 74.93,78.74
N$379  (via drill 1)
  other vias: 85.09,71.5
N$381  (via drill 1)
  other vias: 87.63,71.5
N$382  (via drill 1)
  other vias: 87.63,69.09
N$383  (via drill 1)
  other vias: 77.47,78.74
N$384  (via drill 1)
  other vias: 90.17,71.5
N$385  (via drill 1)
  other vias: 72.39,73.91
N$386  (via drill 1)
  other vias: 92.71,71.5
N$387  (via drill 1)
  other vias: 44.45,69.09
N$388  (via drill 1)
  other vias: 95.25,71.5
N$389  (via drill 1)
  other vias: 74.93,73.91
N$390  (via drill 1)
  other vias: 90.17,69.09
N$392  (via drill 1)
  other vias: 92.71,69.09
N$393  (via drill 1)
  other vias: 77.47,73.91
N$394  (via drill 1)
  other vias: 95.25,69.09
N$395  (via drill 1)
  other vias: 49.53,71.5
N$396  (via drill 1)
  other vias: 90.17,66.67
N$397  (via drill 1)
  other vias: 80.01,76.33
N$398  (via drill 1)
  other vias: 92.71,66.67
N$399  (via drill 1)
  other vias: 24.13,76.33
N$400  (via drill 1)
  other vias: 95.25,66.67
N$401  (via drill 1)
  other vias: 82.55,76.33
N$402  (via drill 1)
  other vias: 90.17,64.26
N$403  (via drill 1)
  other vias: 46.99,71.5
N$404  (via drill 1)
  other vias: 90.17,61.98
N$406  (via drill 1)
  other vias: 80.01,73.91
N$407  (via drill 1)
  other vias: 44.45,71.5
N$408  (via drill 1)
  other vias: 82.55,73.91
N$410  (via drill 1)
  other vias: 49.53,73.91
N$411  (via drill 1)
  other vias: 80.01,78.74
N$413  (via drill 1)
  other vias: 82.55,78.74
N$414  (via drill 1)
  other vias: 46.99,73.91
N$415  (via drill 1)
  other vias: 85.09,73.91
N$416  (via drill 1)
  other vias: 31.75,73.91
N$417  (via drill 1)
  other vias: 87.63,73.91
N$418  (via drill 1)
  other vias: 44.45,73.91
N$419  (via drill 1)
  other vias: 90.17,73.91
N$421  (via drill 1)
  other vias: 85.09,76.33
N$422  (via drill 1)
  other vias: 49.53,76.33
N$423  (via drill 1)
  other vias: 87.63,76.33
N$424  (via drill 1)
  other vias: 29.21,73.91
N$425  (via drill 1)
  other vias: 90.17,76.33
N$426  (via drill 1)
  other vias: 46.99,76.33
N$427  (via drill 1)
  other vias: 85.09,78.74
N$429  (via drill 1)
  other vias: 87.63,78.74
N$430  (via drill 1)
  other vias: 44.45,76.33
N$431  (via drill 1)
  other vias: 90.17,78.74
N$432  (via drill 1)
  other vias: 26.67,73.91
N$433  (via drill 1)
  other vias: 92.71,73.91
N$434  (via drill 1)
  other vias: 49.53,78.74
N$435  (via drill 1)
  other vias: 92.71,76.33
N$437  (via drill 1)
  other vias: 95.25,76.33
N$438  (via drill 1)
  other vias: 46.99,78.74
N$439  (via drill 1)
  other vias: 97.79,76.33
N$440  (via drill 1)
  other vias: 24.13,73.91
N$441  (via drill 1)
  other vias: 95.25,73.91
N$442  (via drill 1)
  other vias: 44.45,78.74
N$443  (via drill 1)
  other vias: 97.79,73.91
N$445  (via drill 1)
  other vias: 92.71,78.74
N$446  (via drill 1)
  other vias: 41.91,78.74
N$447  (via drill 1)
  other vias: 95.25,78.74
N$448  (via drill 1)
  other vias: 41.91,71.5
N$449  (via drill 1)
  other vias: 97.79,78.74
N$450  (via drill 1)
  other vias: 39.37,78.74
N$452  (via drill 1)
  other vias: 92.71,61.98
N$453  (via drill 1)
  other vias: 36.83,78.74
N$454  (via drill 1)
  other vias: 95.25,61.98
N$455  (via drill 1)
  other vias: 39.37,71.5
N$456  (via drill 1)
  other vias: 34.29,78.74
N$457  (via drill 1)
  other vias: 92.71,64.26
N$458  (via drill 1)
  other vias: 41.91,76.33
N$459  (via drill 1)
  other vias: 95.25,64.26
N$461  (via drill 1)
  other vias: 97.79,64.26
N$462  (via drill 1)
  other vias: 97.79,61.98
N$463  (via drill 1)
  other vias: 39.37,76.33
N$464  (via drill 1)
  other vias: 36.83,71.5
N$465  (via drill 1)
  other vias: 36.83,76.33
N$467  (via drill 1)
  other vias: 34.29,76.33
N$468  (via drill 1)
  other vias: 41.91,73.91
N$469  (via drill 1)
  other vias: 34.29,71.5
N$470  (via drill 1)
  other vias: 39.37,73.91
N$471  (via drill 1)
  other vias: 41.91,69.09
N$472  (via drill 1)
  other vias: 36.83,73.91
N$474  (via drill 1)
  other vias: 34.29,73.91
N$475  (via drill 1)
  other vias: 39.37,69.09
N$477  (via drill 1)
  other vias: 36.83,69.09
N$479  (via drill 1)
  other vias: 34.29,69.09
N$480  (via drill 1)
  other vias: 41.91,66.67
N$482  (via drill 1)
  other vias: 39.37,66.67
N$484  (via drill 1)
  other vias: 36.83,66.67
N$486  (via drill 1)
  other vias: 34.29,66.67
N$488  (via drill 1)
  other vias: 31.75,71.5
N$490  (via drill 1)
  other vias: 29.21,71.5
N$492  (via drill 1)
  other vias: 26.67,71.5
N$494  (via drill 1)
  other vias: 24.13,71.5
N$496  (via drill 1)
  other vias: 31.75,69.09
N$498  (via drill 1)
  other vias: 29.21,69.09
N$500  (via drill 1)
  other vias: 26.67,69.09
N$502  (via drill 1)
  other vias: 24.13,69.09
N$504  (via drill 1)
  other vias: 31.75,66.67
N$506  (via drill 1)
  other vias: 29.21,66.67
N$508  (via drill 1)
  other vias: 26.67,66.67
N$510  (via drill 1)
  other vias: 24.13,66.67
N$512  (via drill 1)
  other vias: 21.59,66.67
N$514  (via drill 1)
  other vias: 19.05,66.67
N$517  (via drill 1)
  other vias: 21.59,69.09
N$519  (via drill 1)
  other vias: 19.05,69.09
N$521  (via drill 1)
  other vias: 16.51,69.09
N$523  (via drill 1)
  other vias: 13.97,69.09
N$525  (via drill 1)
  other vias: 21.59,71.5
N$527  (via drill 1)
  other vias: 19.05,71.5
N$529  (via drill 1)
  other vias: 16.51,71.5
N$531  (via drill 1)
  other vias: 13.97,71.5
N$532  (via drill 1)
  other vias: 21.59,73.91
N$534  (via drill 1)
  other vias: 19.05,73.91
N$536  (via drill 1)
  other vias: 16.51,73.91
N$538  (via drill 1)
  other vias: 13.97,73.91
N$539  (via drill 1)
  other vias: 21.59,76.33
N$541  (via drill 1)
  other vias: 19.05,76.33
N$543  (via drill 1)
  other vias: 16.51,76.33
N$545  (via drill 1)
  other vias: 13.97,76.33
N$546  (via drill 1)
  other vias: 21.59,78.74
N$548  (via drill 1)
  other vias: 19.05,78.74
N$550  (via drill 1)
  other vias: 16.51,78.74
N$552  (via drill 1)
  other vias: 13.97,78.74
N$554  (via drill 1)
  other vias: 11.43,78.74
N$556  (via drill 1)
  other vias: 8.89,78.74
N$559  (via drill 1)
  other vias: 11.43,76.33
N$561  (via drill 1)
  other vias: 8.89,76.33
N$563  (via drill 1)
  other vias: 6.35,76.33
N$565  (via drill 1)
  other vias: 3.81,76.33
N$567  (via drill 1)
  other vias: 1.27,76.33
N$568  (via drill 1)
  other vias: 6.35,78.74
N$570  (via drill 1)
  other vias: 3.81,78.74
N$572  (via drill 1)
  other vias: 1.27,78.87
N$574  (via drill 1)
  other vias: 11.43,71.5
N$576  (via drill 1)
  other vias: 8.89,71.5
N$578  (via drill 1)
  other vias: 11.43,73.91
N$580  (via drill 1)
  other vias: 8.89,73.91
N$582  (via drill 1)
  other vias: 6.35,71.5
N$585  (via drill 1)
  other vias: 6.35,73.91
N$587  (via drill 1)
  other vias: 3.81,71.5
N$589  (via drill 1)
  other vias: 1.27,71.5
N$590  (via drill 1)
  other vias: 3.81,73.91
N$592  (via drill 1)
  other vias: 1.27,73.91
N$594  (via drill 1)
  other vias: 11.43,69.09
N$597  (via drill 1)
  other vias: 8.89,66.67
N$599  (via drill 1)
  other vias: 8.89,69.09
N$601  (via drill 1)
  other vias: 6.35,66.67
N$603  (via drill 1)
  other vias: 3.81,66.67
N$604  (via drill 1)
  other vias: 6.35,69.09
N$606  (via drill 1)
  other vias: 3.81,69.09
N$608  (via drill 1)
  other vias: 1.27,66.67
N$610  (via drill 1)
  other vias: 1.27,69.09
N$611  (via drill 1)
  other vias: 1.27,64.26
N$612  (via drill 1)
  other vias: 1.27,61.85
N$614  (via drill 1)
  other vias: 3.81,61.85
N$617  (via drill 1)
  other vias: 3.81,64.26
N$619  (via drill 1)
  other vias: 6.35,61.85
N$621  (via drill 1)
  other vias: 8.89,61.85
N$623  (via drill 1)
  other vias: 11.43,61.85
N$624  (via drill 1)
  other vias: 6.35,64.26
N$626  (via drill 1)
  other vias: 8.89,64.26
N$631  (via drill 1)
  other vias: 16.51,61.85
N$633  (via drill 1)
  other vias: 19.05,61.85
N$635  (via drill 1)
  other vias: 21.59,61.85
N$637  (via drill 1)
  other vias: 19.05,64.26
N$639  (via drill 1)
  other vias: 21.59,64.26
N$641  (via drill 1)
  other vias: 24.13,64.26
N$643  (via drill 1)
  other vias: 26.67,64.26
N$646  (via drill 1)
  other vias: 24.13,61.85
N$648  (via drill 1)
  other vias: 26.67,61.85
N$650  (via drill 1)
  other vias: 29.21,61.85
N$652  (via drill 1)
  other vias: 31.75,61.85
N$654  (via drill 1)
  other vias: 29.21,64.26
N$656  (via drill 1)
  other vias: 31.75,64.26
N$658  (via drill 1)
  other vias: 34.29,61.85
N$660  (via drill 1)
  other vias: 36.83,61.85
N$661  (via drill 1)
  other vias: 34.29,64.26
N$663  (via drill 1)
  other vias: 36.83,64.26
N$665  (via drill 1)
  other vias: 39.37,61.85
N$667  (via drill 1)
  other vias: 41.91,61.85
N$668  (via drill 1)
  other vias: 41.91,64.26
N$670  (via drill 1)
  other vias: 39.37,64.26
OW  (2 unrouted)
  Bottom 0.406: JP4.1 31.63,7.62 | R2.2 34.17,2.54 33.02,1.4 28.45,1.4 28.07,1.78 28.07,4.19 28.58,4.7 29.72,4.7 30.23,4.57 D2.3 30.82,4.66 31.5,5.33 R1.1
RESET
  Bottom 0.406: 51.12,5.33 50.8,5.65 52.84,5.65 52.96,9.53 56.77,13.59 52.84,13.59 52.58,13.34 52.53,13.39 IC1.4 | 84.78,5.33 85.09,5.65 85.09,8.26 86.36,9.53 J1.5
  Bottom 0.61: 51.12,5.33 84.78,5.33
SCK
  Bottom 0.406: SV4.3 53.74,46.43 | 70.96,46.2 72.08,45.09 84.3,45.09 85.56,46.35 SV6.3 87.32,46.35 88.59,45.09 96.49,45.09 96.49,12.38 89.22,12.38 88.9,12.06 J1.3 88.9,9.53 87.63,8.26 87.63,3.75 | 70.96,46.2 | 70.96,46.2 70.81,46.35 70.33,46.35 70.33,46.36 SV5.3 70.17,46.36 70.17,46.35 69.54,46.35 68.27,45.09 55.72,45.09 54.45,46.35 53.82,46.35 53.82,46.36 SV4.3 | SV4.3 53.03,46.36 51.76,45.09 39.21,45.09 37.94,46.35 37.31,46.35 SV3.3 36.51,46.35 35.25,45.09 22.7,45.09 21.43,46.35 20.8,46.35 SV2.3 20.16,46.35 18.89,45.09 6.19,45.09 4.92,46.35 4.29,46.35 4.28,46.35 SV1.3 | 42.23,3.43 42.23,9.34 42.68,9.78 52.45,9.91 54.36,12.06 53.6,12.06 53.09,12.57 52.33,12.57 52.31,12.59 IC1.3
  Bottom 0.508: 42.23,3.43 41.91,3.75
  Bottom 0.61: 42.23,3.43 87.32,3.43 87.63,3.75
VCC  (5 unrouted)
VIN  (via drill 1)
  Bottom 0.406: 68.26,48.9 68.27,48.9 69.54,50.16 70.96,50.16 72.23,48.9 SV5.2 72.87,48.9 84.14,48.9 85.41,50.16 87.32,50.16 88.59,48.89 SV6.2 89.23,48.89 89.22,48.9 99.44,48.9 | SV4.2 55.72,48.9 54.45,50.16 53.03,50.16 51.76,48.9 | 39.85,48.9 39.85,48.89 SV3.2 39.22,48.89 37.94,50.16 36.52,50.16 35.25,48.9 | 23.34,48.9 23.34,48.89 SV2.2 22.71,48.89 21.43,50.16 20.16,50.16 18.89,48.9 | 6.83,48.9 6.82,48.89 SV1.2 | 91.13,0.45 91.44,0.76 | 92.4,8.57 92.71,8.57 | JP3.2 | JP3.2 | 24.27,16.76 U$1.1
  Bottom 0.508: 68.26,48.9 SV4.2 | 51.76,48.9 39.85,48.9 | 35.25,48.9 23.34,48.9 | 18.89,48.9 6.83,48.9 | 19.05,16.76 24.27,16.76
  Bottom 0.813: 91.44,0.76 J1.2 92.4,8.57 | 92.71,8.57 93.03,8.89 99.44,8.89 99.44,48.9 | 91.13,0.45 19.05,0.45 v19.05,2.54 v19.05,5.08 JP3.2 | JP3.2 19.05,16.76
VSS  (11 unrouted)
  Bottom 0.406: 56.36,43.81 56.36,43.82 SV4.6 55.72,43.82 54.45,45.09 53.03,45.09 51.75,43.81 | SV5.6 72.23,43.82 70.96,45.09 69.54,45.09 68.27,43.81 68.26,43.82 | 85.57,45.09 87.47,45.09 88.75,43.81 SV6.6 95.37,43.81 95.51,43.81 95.51,13.34 88.9,13.34 87.63,12.06 87.63,9.53 86.36,8.26 J1.6 | SV3.6 39.22,43.81 37.94,45.09 36.52,45.09 35.25,43.81 | 23.34,43.81 SV2.6 22.71,43.81 21.43,45.09 20.16,45.09 18.89,43.81 | 6.83,43.81 6.82,43.81 SV1.6 | 46.99,20.57 46.99,21.59 | 49.98,4.38 49.53,5.08 | JP3.4 | JP3.4 | JP3.4 21.59,9.91 25.28,9.91 U$1.3 26.67,9.95 26.67,19.56 30.23,19.56 | D2.1 31.67,2.46 JP5.2 | JP5.2 34.8,5.59 34.93,5.46 R1.2 34.8,5.33 34.55,5.08 JP5.2
  Bottom 0.508: 56.36,43.82 68.26,43.82 | SV3.6 51.75,43.81 | 23.34,43.81 35.25,43.81 | 6.83,43.81 18.89,43.81 | JP5.2 JP4.3 | 46.99,20.57 46.99,25.02 47.63,25.65 49.53,25.65 49.66,25.78 50.8,24.64
  Bottom 0.61: SV5.6 84.3,43.82 85.57,45.09 | J1.6 86.36,4.7 86.05,4.38 49.98,4.38
(copper drawn outside any net)
  shapes: Bottom area x122, Bottom circle x4

### Text on the board
Dimension: 80 | 65 | 40 | 15 | 85.75 | 14.25
tPlace: 0.5 | 17.0 | 33.5 | 50.0 | 66.5 | 83.0 | 99.5
tOrigins: ISP | (USB) | VIN | EVCC | VSS | OW | VSS | GPIO | VCC | VSS | SDA | SCL | EGND | AREF